# Altium schematic sheet Top.SchDoc
size A4
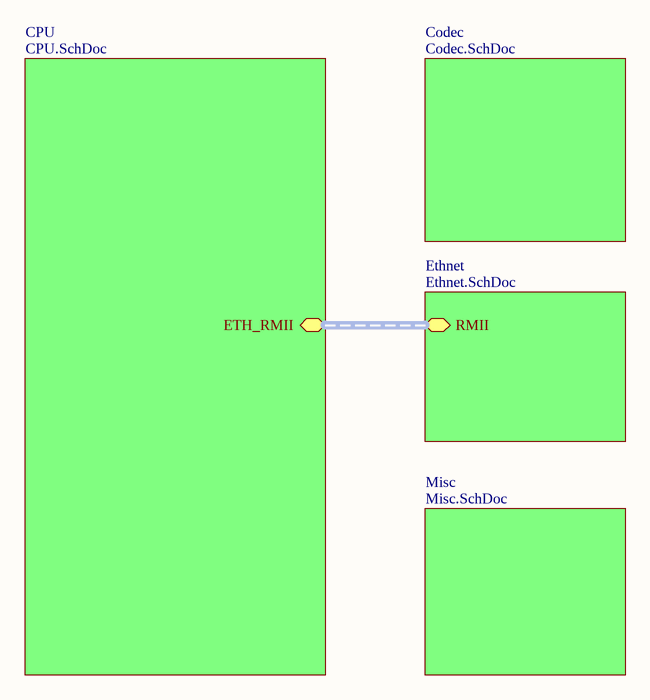
[diagram p0: Top.SchDoc]

## Sub-sheets
Codec = Codec.SchDoc: no entries
CPU = CPU.SchDoc: ETH_RMII (harness RMII)
Ethnet = Ethnet.SchDoc: RMII (harness RMII)
Misc = Misc.SchDoc: no entries

## Buses and harness runs
harness sheet CPU/ETH_RMII = sheet Ethnet/RMII